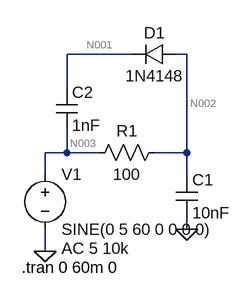
[diagram p0: schematic Draft3.asc]
Draft3.asc, the LTspice schematic file:
Version 4
SHEET 1 880 680
WIRE 128 -48 32 -48
WIRE 208 -48 192 -48
WIRE 32 0 32 -48
WIRE 32 96 32 64
WIRE 32 96 0 96
WIRE 80 96 32 96
WIRE 208 96 208 -48
WIRE 208 96 160 96
WIRE 0 128 0 96
WIRE 208 128 208 96
WIRE 208 208 208 192
WIRE 0 240 0 208
FLAG 0 240 0
FLAG 208 208 0
SYMBOL res 176 80 R90
WINDOW 0 0 56 VBottom 2
WINDOW 3 32 56 VTop 2
SYMATTR InstName R1
SYMATTR Value 100
SYMBOL cap 192 128 R0
SYMATTR InstName C1
SYMATTR Value 10nF
SYMBOL voltage 0 112 R0
WINDOW 123 24 124 Left 2
WINDOW 39 0 0 Left 2
SYMATTR InstName V1
SYMATTR Value SINE(0 5 60 0 0 0 0)
SYMATTR Value2 AC 5 10k
SYMATTR SpiceLine ""
SYMBOL cap 16 0 R0
SYMATTR InstName C2
SYMATTR Value 1nF
SYMBOL diode 192 -64 R90
WINDOW 0 0 32 VBottom 2
WINDOW 3 32 32 VTop 2
SYMATTR InstName D1
SYMATTR Value 1N4148
TEXT -34 264 Left 2 !.tran 0 60m 0

The netlist it stands for:
* Draft3.asc
R1 N002 N003 100
C1 N002 0 10nF
V1 N003 0 SINE(0 5 60 0 0 0 0) AC 5 10k
C2 N001 N003 1nF
D1 N002 N001 1N4148
.model D D
.lib standard.dio
.tran 0 60m 0
.backanno
.end

* Results of the author's LTspice run, read from the files saved beside the schematic
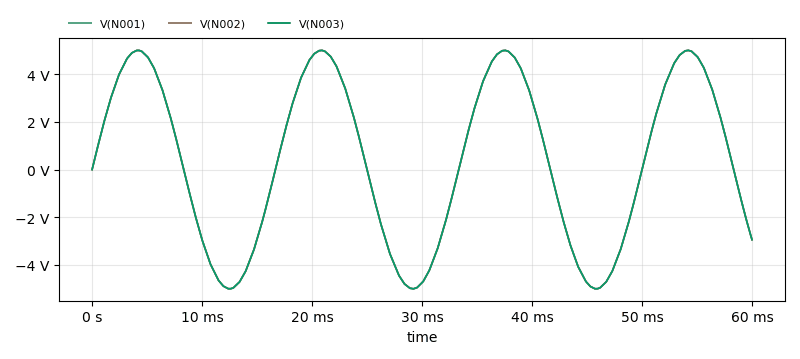
[diagram p1: Transient Analysis of Draft3.asc, plotted from the saved traces]
* Transient Analysis, 1 run:
*   V(N001): min -4.998 V, max 4.998 V, average 397.8 mV, rms 3.497 V, last -2.939 V
*   V(N002): min -4.998 V, max 4.999 V, average 397.8 mV, rms 3.497 V, last -2.937 V
*   V(N003): min -4.998 V, max 4.999 V, average 397.8 mV, rms 3.497 V, last -2.939 V